# Altium project FPGA_SHIELD_MARK1.PrjPcb (part 2 of 2)

## Sheet LOGIC_MCU.SchDoc: MCU Logic
size B; Engineer: M. Jones; Organization: Michael Jones; DocumentNumber: 5; Revision: RA.1; SheetNumber: 5; SheetTotal: 7
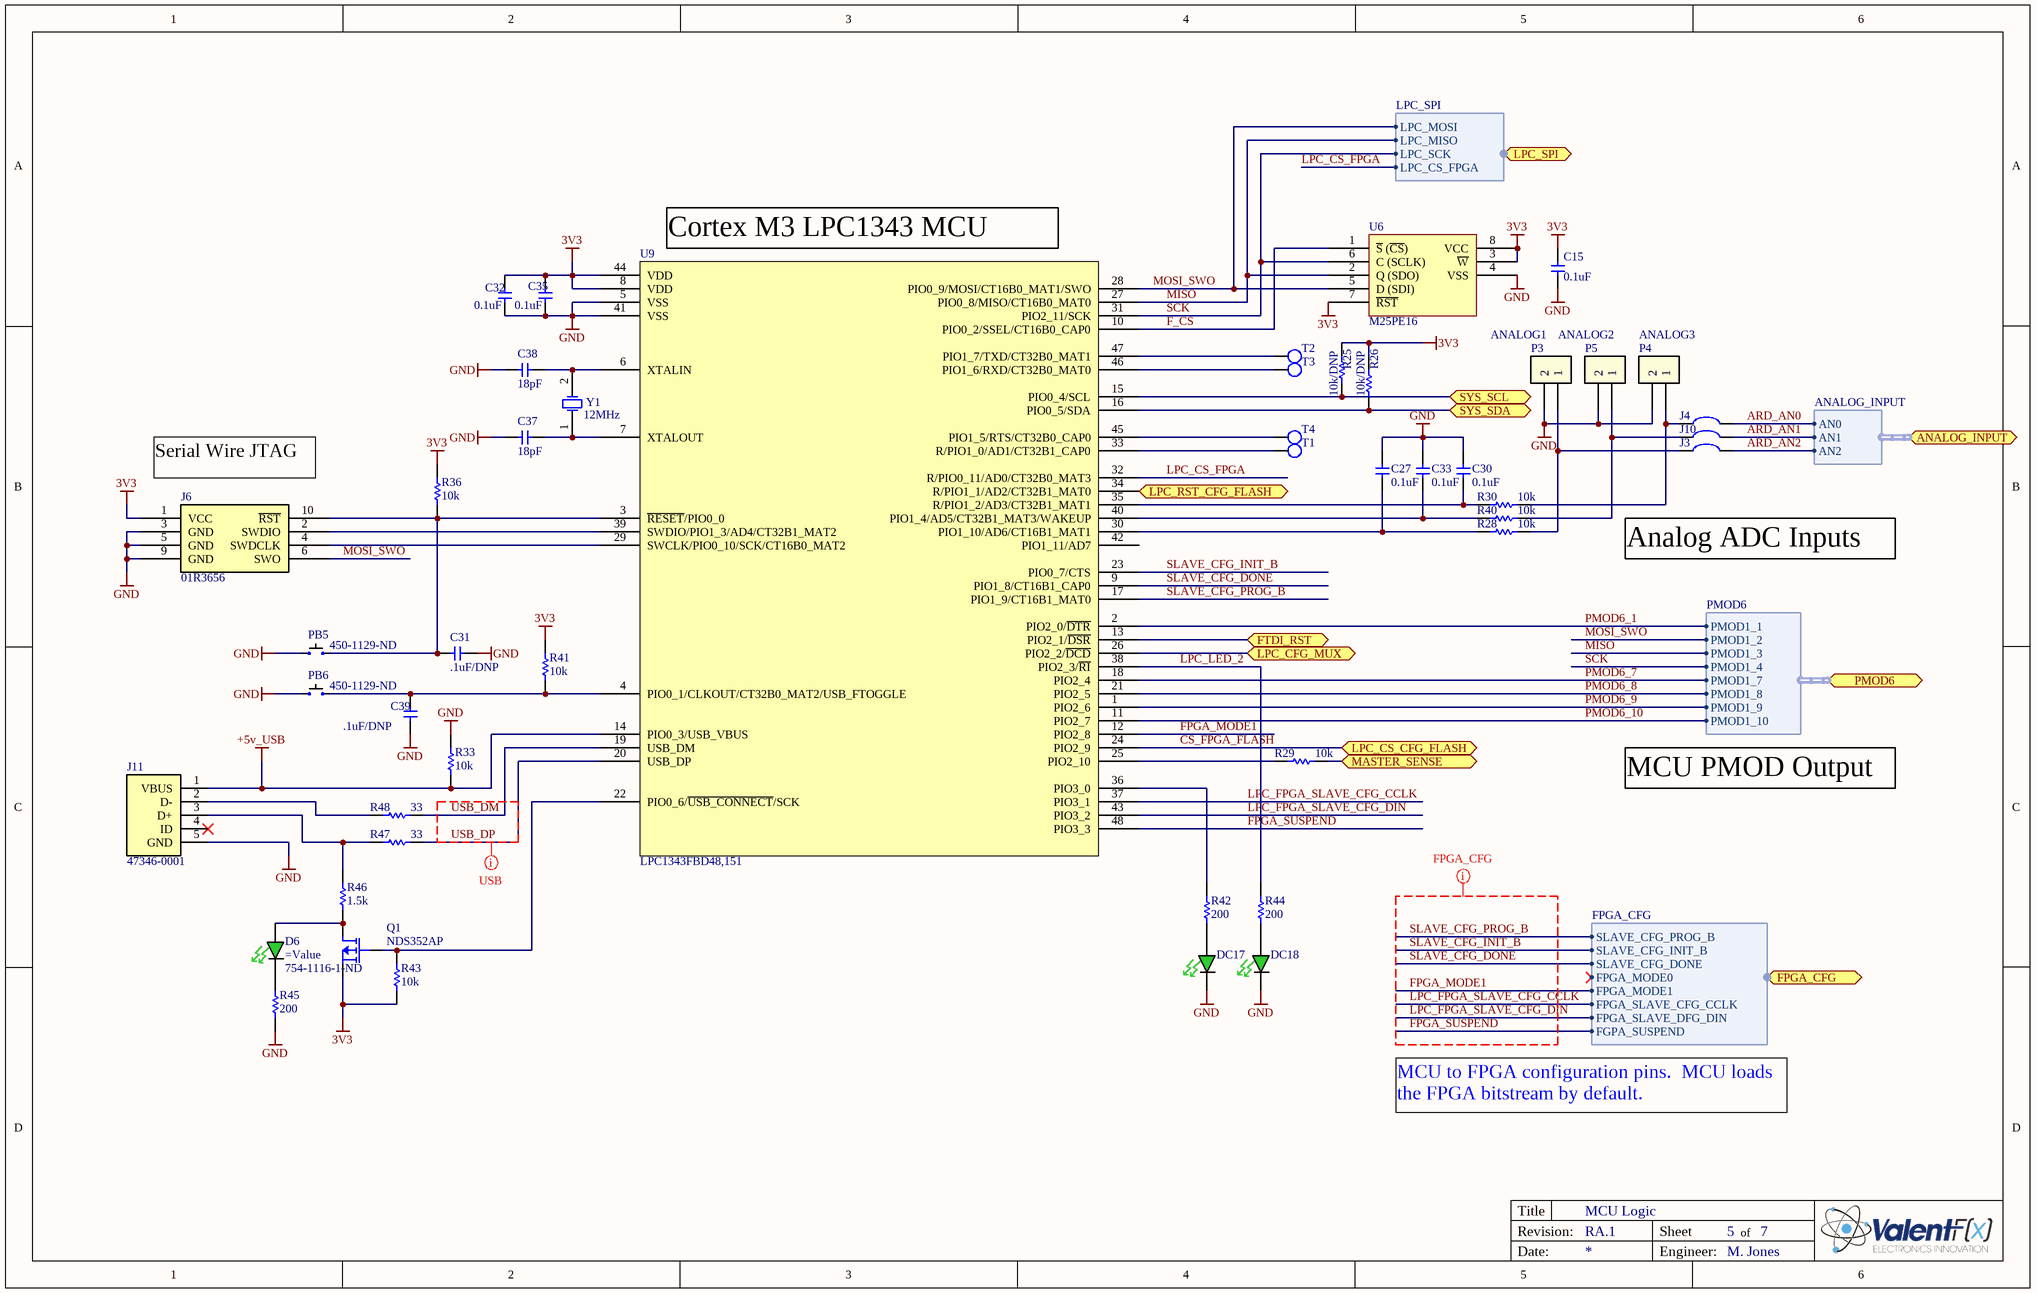
[diagram p4: LOGIC_MCU.SchDoc]

### Parts
C15  0.1uF  [C0603]
C27  0.1uF  [C0603]
C30  0.1uF  [C0603]
C31  .1uF/DNP  [C0603]
C32  0.1uF  [C0603]
C33  0.1uF  [C0603]
C35  0.1uF  [C0603]
C37  18pF  [C0603]
C38  18pF  [C0603]
C39  .1uF/DNP  [C0603]
D6  Supplier Part Number 1: 754-1116-1-ND  [LED_0603 - GREEN]
DC17  (no value)  [LED_0603 - GREEN]
DC18  (no value)  [LED_0603 - GREEN]
J3  Solder Jumper  [SOLDER_JUMPER SMALL 2]  (value not drawn)
J4  Solder Jumper  [SOLDER_JUMPER SMALL 2]  (value not drawn)
J6  01R3656  [FTSH-105-04-F-DV]
J10  Solder Jumper  [SOLDER_JUMPER SMALL 2]  (value not drawn)
J11  47346-0001  [USB - 47346-0001]
P3  ANALOG1  [HEADER_2_30_100 THRU SIP]
P4  ANALOG3  [HEADER_2_30_100 THRU SIP]
P5  ANALOG2  [HEADER_2_30_100 THRU SIP]
PB5  Supplier Part Number 1: 450-1129-ND  [FSM4JSMA]
PB6  Supplier Part Number 1: 450-1129-ND  [FSM4JSMA]
Q1  NDS352AP  [SOT-23]
R25  value 10k/DNP  [R0603]  (hidden comment: 10k)
R26  value 10k/DNP  [R0603]  (hidden comment: 10k)
R28  10k  [R0603]
R29  10k  [R0603]
R30  10k  [R0603]
R33  10k  [R0603]
R36  10k  [R0603]
R40  10k  [R0603]
R41  10k  [R0603]
R42  200  [R0603]
R43  10k  [R0603]
R44  200  [R0603]
R45  200  [R0603]
R46  1.5k  [R0603]
R47  33  [R0603]
R48  33  [R0603]
T1  Test Point  [tp 18-28]  (value not drawn)
T2  Test Point  [tp 18-28]  (value not drawn)
T3  Test Point  [tp 18-28]  (value not drawn)
T4  Test Point  [tp 18-28]  (value not drawn)
U6  M25PE16  [SOIC127P830X200-8L]
U9  LPC1343FBD48,151  [TSQFP50P900X900X145-48L]
Y1  12MHz  [ABM3]

### Ports
ANALOG_INPUT (harness ANALOG_INPUT), FPGA_CFG (harness FPGA_CFG), FTDI_RST, LPC_CFG_MUX, LPC_CS_CFG_FLASH, LPC_RST_CFG_FLASH, LPC_SPI (harness LPC_SPI), MASTER_SENSE, PMOD6 (harness PMOD6), SYS_SCL, SYS_SDA

### Harnesses
FPGA_CFG: SLAVE_CFG_PROG_B, SLAVE_CFG_INIT_B, SLAVE_CFG_DONE, FPGA_MODE0, FPGA_MODE1, FPGA_SLAVE_CFG_CCLK, FPGA_SLAVE_DFG_DIN, FGPA_SUSPEND
PMOD6: PMOD1_1, PMOD1_2, PMOD1_3, PMOD1_4, PMOD1_7, PMOD1_8, PMOD1_9, PMOD1_10
ANALOG_INPUT: AN0, AN1, AN2
LPC_SPI: LPC_MOSI, LPC_MISO, LPC_SCK, LPC_CS_FPGA

### Nets
3V3: C15.2 C32.2 C35.2 J6.1(VCC) Q1.2(S) R25.2 R26.2 R36.1 R41.1 R43.2 U6.3(~{W}) U6.7(~{RST}) U6.8(VCC) U9.8(VDD) U9.44(VDD)
+5v_USB: J11.1(VBUS) R33.2 U9.14(PIO0_3/USB_VBUS)
GND: C15.1 C27.2 C30.2 C31.1 C32.1 C33.2 C35.1 C37.1 C38.1 C39.1 DC17.C DC18.C J6.3(GND) J6.5(GND) J6.9(GND) J11.5(GND) P3.2 P4.2 P5.2 PB5.A PB6.A R33.1 R45.1 U6.4(VSS) U9.5(VSS) U9.41(VSS)
ARD_AN0: J4.2 ; port ANALOG_INPUT.AN0  [project net AN0]
ARD_AN1: J10.2 ; port ANALOG_INPUT.AN1  [project net AN1]
ARD_AN2: J3.2 ; port ANALOG_INPUT.AN2  [project net AN2]
CS_FPGA_FLASH: U9.24(PIO2_9) ; port LPC_CS_CFG_FLASH
F_CS: U6.1(~{S}_(~{CS})) U9.10(PIO0_2/SSEL/CT16B0_CAP0)
FPGA_MODE1: U9.12(PIO2_8) ; port FPGA_CFG.FPGA_MODE1
FPGA_SUSPEND: U9.48(PIO3_3) ; port FPGA_CFG.FGPA_SUSPEND
FTDI_RST: U9.13(PIO2_1/~{DSR}) ; port FTDI_RST
LPC_CS_FPGA: U9.32(R/PIO0_11/AD0/CT32B0_MAT3) ; port LPC_SPI.LPC_CS_FPGA
LPC_FPGA_SLAVE_CFG_CCLK: U9.37(PIO3_1) ; port FPGA_CFG.FPGA_SLAVE_CFG_CCLK
LPC_FPGA_SLAVE_CFG_DIN: U9.43(PIO3_2) ; port FPGA_CFG.FPGA_SLAVE_DFG_DIN
LPC_LED_2: R44.1 U9.38(PIO2_3/~{RI})
MASTER_SENSE: R29.2 ; port MASTER_SENSE
MISO: U6.2(Q_(SDO)) U9.27(PIO0_8/MISO/CT16B0_MAT0) ; port PMOD6.PMOD1_3, port LPC_SPI.LPC_MISO
MOSI_SWO: J6.6(SWO) U6.5(D_(SDI)) U9.28(PIO0_9/MOSI/CT16B0_MAT1/SWO) ; port PMOD6.PMOD1_2, port LPC_SPI.LPC_MOSI
PMOD6_1: U9.2(PIO2_0/~{DTR}) ; port PMOD6.PMOD1_1
PMOD6_7: U9.18(PIO2_4) ; port PMOD6.PMOD1_7
PMOD6_8: U9.21(PIO2_5) ; port PMOD6.PMOD1_8
PMOD6_9: U9.1(PIO2_6) ; port PMOD6.PMOD1_9
PMOD6_10: U9.11(PIO2_7) ; port PMOD6.PMOD1_10
SCK: U6.6(C_(SCLK)) U9.31(PIO2_11/SCK) ; port PMOD6.PMOD1_4, port LPC_SPI.LPC_SCK
SLAVE_CFG_DONE: U9.9(PIO1_8/CT16B1_CAP0) ; port FPGA_CFG.SLAVE_CFG_DONE
SLAVE_CFG_INIT_B: U9.23(PIO0_7/CTS) ; port FPGA_CFG.SLAVE_CFG_INIT_B
SLAVE_CFG_PROG_B: U9.17(PIO1_9/CT16B1_MAT0) ; port FPGA_CFG.SLAVE_CFG_PROG_B
SYS_I2C_SCL: R25.1 U9.15(PIO0_4/SCL) ; port SYS_SCL
SYS_I2C_SDA: R26.1 U9.16(PIO0_5/SDA) ; port SYS_SDA
USB_DM: R48.2 U9.19(USB_DM)
USB_DP: R47.2 U9.20(USB_DP)
NetC27_1: C27.1 R28.1 U9.30(PIO1_10/AD6/CT16B1_MAT1)
NetC30_1: C30.1 R30.1 U9.35(R/PIO1_2/AD3/CT32B1_MAT1)
NetC31_2: C31.2 J6.10(~{RST}) PB5.B R36.2 U9.3(~{RESET}/PIO0_0)
NetC33_1: C33.1 R40.1 U9.40(PIO1_4/AD5/CT32B1_MAT3/WAKEUP)
NetC37_2: C37.2 U9.7(XTALOUT) Y1.1(OSC1)
NetC38_2: C38.2 U9.6(XTALIN) Y1.2(OSC2)
NetC39_2: C39.2 PB6.B R41.2 U9.4(PIO0_1/CLKOUT/CT32B0_MAT2/USB_FTOGGLE)
NetD6_A: D6.A Q1.3(D) R46.1
NetD6_C: D6.C R45.2
NetDC17_A: DC17.A R42.2
NetDC18_A: DC18.A R44.2
NetJ3_1: J3.1 P3.1 R28.2
NetJ4_1: J4.1 P4.1 R30.2
NetJ6_2: J6.2(SWDIO) U9.39(SWDIO/PIO1_3/AD4/CT32B1_MAT2)
NetJ6_4: J6.4(SWDCLK) U9.29(SWCLK/PIO0_10/SCK/CT16B0_MAT2)
NetJ10_1: J10.1 P5.1 R40.2
NetJ11_2: J11.2(D-) R48.1
NetJ11_3: J11.3(D+) R46.2 R47.1
NetQ1_1: Q1.1(G) R43.1 U9.22(PIO0_6/~{USB_CON}~{NECT}/SCK)
NetR29_1: R29.1 U9.25(PIO2_10)
NetR35_1: U9.34(R/PIO1_1/AD2/CT32B1_MAT0) ; port LPC_RST_CFG_FLASH
NetR42_1: R42.1 U9.36(PIO3_0)
NetR49_2: U9.26(PIO2_2/~{DCD}) ; port LPC_CFG_MUX
NetT1_1: T1.1 U9.33(R/PIO1_0/AD1/CT32B1_CAP0)
NetT2_1: T2.1 U9.47(PIO1_7/TXD/CT32B0_MAT1)
NetT3_1: T3.1 U9.46(PIO1_6/RXD/CT32B0_MAT0)
NetT4_1: T4.1 U9.45(PIO1_5/RTS/CT32B0_CAP0)

Not connected (* = marked no-connect by the designer): J11 4(ID)*; U9 42(PIO1_11/AD7)

### Layout directives
net class FPGA_CFG: FPGA_MODE1, FPGA_SUSPEND, LPC_FPGA_SLAVE_CFG_CCLK, LPC_FPGA_SLAVE_CFG_DIN, SLAVE_CFG_DONE, SLAVE_CFG_INIT_B, SLAVE_CFG_PROG_B
net class USB: USB_DP

### Notes on the sheet
- (near U9) Cortex M3 LPC1343 MCU
- (near J6) Serial Wire JTAG
- Analog ADC Inputs
- MCU PMOD Output
- MCU to FPGA configuration pins.  MCU loads the FPGA bitstream by default.
- Title
- Revision:
- Sheet
- of
- Date:
- Engineer:

### Library data of the parts
C15 C27 C30 C32 C33 C35 = GRM188R71H104KA93D: CAP CER .1UF 50V 10% X7R 0603; Manufacturer: Murata Electronics North America; Capacitance: 0.1µF; Value: 0.1uF; Supplier 1: Digi-Key; Supplier Part Number 1: 490-1519-1-ND; Manufacturer Part Number: GRM188R71H104KA93D; RoHS: RoHS Compliant; Category: Capacitors; Stock 1: 6315460; Pricing 1: 10=0.037, 100=0.0221, 500=0.01276, 1000=0.00884 (USD); Voltage - Rated: 50V; Tolerance: ±10%; Temperature Coefficient: X7R; Mounting Type: Surface Mount, MLCC; Operating Temperature: -55°C ~ 125°C; Features: -; Applications: General Purpose; Ratings: -; Package / Case: 0603 (1608 Metric); Size / Dimension: 0.063" L x 0.031" W (1.60mm x 0.80mm); Lead Spacing: -; Thickness: 0.80mm; Packaging: Cut Tape (CT); Lead Style: -; ComponentLink1URL: http://search.murata.co.jp/Ceramy/image/img/PDF/ENG/GRM188R71H104KA93.pdf; ComponentLink1Description: http://search.murata.co.jp/Ceramy/image/img/PDF/ENG/GRM188R71H104KA93.pdf
C31 C39 = GRM188R71H104KA93D: CAP CER .1UF 50V 10% X7R 0603; Manufacturer: Murata Electronics North America; Value: 0.1uF; Capacitance: 0.1µF; Supplier 1: Digi-Key; Supplier Part Number 1: 490-1519-1-ND; Manufacturer Part Number: GRM188R71H104KA93D; RoHS: RoHS Compliant; Category: Capacitors; Stock 1: 6315460; Pricing 1: 10=0.037, 100=0.0221, 500=0.01276, 1000=0.00884 (USD); Voltage - Rated: 50V; Tolerance: ±10%; Temperature Coefficient: X7R; Mounting Type: Surface Mount, MLCC; Operating Temperature: -55°C ~ 125°C; Features: -; Applications: General Purpose; Ratings: -; Package / Case: 0603 (1608 Metric); Size / Dimension: 0.063" L x 0.031" W (1.60mm x 0.80mm); Lead Spacing: -; Thickness: 0.80mm; Packaging: Cut Tape (CT); Lead Style: -; ComponentLink1URL: http://search.murata.co.jp/Ceramy/image/img/PDF/ENG/GRM188R71H104KA93.pdf; ComponentLink1Description: http://search.murata.co.jp/Ceramy/image/img/PDF/ENG/GRM188R71H104KA93.pdf
C37 C38 = GRM1885C1H180JA01D: CAP CER 18PF 50V 5% C0G 0603; Source Part Number: 490-1409-1-ND; Manufacturer: Murata Electronics North America; Temperature Coefficient: C0G, NP0; Source: Digikey; Manufacturer Part Number: GRM1885C1H180JA01D; ROHS Certificate: *; Value: CAP CER 18PF 50V 5% C0G 0603; Supplier 1: Digi-Key; Supplier Part Number 1: 490-1409-1-ND; RoHS: RoHS Compliant; Category: Capacitors; Stock 1: 357140; Pricing 1: 10=0.037, 100=0.0221, 500=0.01276, 1000=0.00884 (USD); Capacitance: 18pF; Voltage - Rated: 50V; Tolerance: ±5%; Mounting Type: Surface Mount, MLCC; Operating Temperature: -55°C ~ 125°C; Features: -; Applications: General Purpose; Ratings: -; Package / Case: 0603 (1608 Metric); Size / Dimension: 0.063" L x 0.031" W (1.60mm x 0.80mm); Lead Spacing: -; Thickness: 0.80mm; Packaging: Cut Tape (CT); Lead Style: -; ComponentLink1URL: http://search.murata.co.jp/Ceramy/image/img/PDF/ENG/GRM1885C1H180JA01.pdf; ComponentLink1Description: http://search.murata.co.jp/Ceramy/image/img/PDF/ENG/GRM1885C1H180JA01.pdf
D6 = APT1608CGCK: LED 1.6X0.8MM 570NM GRN CLR SMD; Manufacturer: Kingbright Corp; Color: Green; Current - Test: 20mA; Wavelength - Peak: 574nm; Millicandela Rating: 50mcd; Voltage - Forward (Vf) Typ: 2.1V; Lens Type: Clear; Lens Style/Size: Rectangle with Flat Top, 1.2mm x 0.8mm; Viewing Angle: 120°; Supplier 1: Digi-Key; Manufacturer Part Number: APT1608CGCK; RoHS: RoHS Compliant; Category: Optoelectronics; Stock 1: 98122; Pricing 1: 1=0.2, 10=0.153, 25=0.1224, 100=0.1105, 250=0.102, 500=0.0918 (USD); Luminous Flux @ Current - Test: -; Wavelength - Dominant: 570nm; Size / Dimension: 1.60mm L x 0.80mm W; Height: 0.75mm; Package / Case: 0603 (1608 Metric); Mounting Type: Surface Mount; Packaging: Cut Tape (CT); ComponentLink1URL: http://www.us.kingbright.com/images/catalog/SPEC/APT1608CGCK.pdf; ComponentLink1Description: http://www.us.kingbright.com/images/catalog/SPEC/APT1608CGCK.pdf
DC17 DC18 = APT1608CGCK: LED 1.6X0.8MM 570NM GRN CLR SMD; Manufacturer: Kingbright Corp; Current - Test: 20mA; Wavelength - Peak: 574nm; Millicandela Rating: 50mcd; Voltage - Forward (Vf) Typ: 2.1V; Lens Type: Clear; Lens Style/Size: Rectangle with Flat Top, 1.2mm x 0.8mm; Viewing Angle: 120°; Supplier 1: Digi-Key; Supplier Part Number 1: 754-1116-1-ND; Manufacturer Part Number: APT1608CGCK; RoHS: RoHS Compliant; Category: Optoelectronics; Stock 1: 98122; Pricing 1: 1=0.2, 10=0.153, 25=0.1224, 100=0.1105, 250=0.102, 500=0.0918 (USD); Color: Green; Luminous Flux @ Current - Test: -; Wavelength - Dominant: 570nm; Size / Dimension: 1.60mm L x 0.80mm W; Height: 0.75mm; Package / Case: 0603 (1608 Metric); Mounting Type: Surface Mount; Packaging: Cut Tape (CT); ComponentLink1URL: http://www.us.kingbright.com/images/catalog/SPEC/APT1608CGCK.pdf; ComponentLink1Description: http://www.us.kingbright.com/images/catalog/SPEC/APT1608CGCK.pdf
J3 J4 J10 = Solder Jumper: Solder/Configuration Jumper; Manufacturer: n/a; Manufacturer Part Number: n/a; Source: n/a; Source Part Number: n/a; ROHS Certificate: n/a
J6 = Cortex SWD  Connector: Cortex SWD Connector; Manufacturer: SAMTEC; Description: SAMTEC - FTSH-105-04-F-DV - .050 X .050; Supplier 1: Newark; Supplier Part Number 1: 01R3656; Manufacturer Part Number: FTSH-105-04-F-DV; Category: Connectors; Stock 1: 0; Pricing 1: 1=0.871, 25000=0.754, 50000=0.705 (USD); Value: 01R3656
J11 = USB - 0473460001: Micro B CONN RCPT 5POS MICRO B USB R/A; Manufacturer: Molex Inc; Description: CONN RCPT 5POS MICRO USB R/A; Connector Type: USB - micro B; Number of Contacts: 5; Gender: Receptacle; Supplier 1: Digi-Key; Manufacturer Part Number: 0473460001; RoHS: RoHS Compliant; Category: Connectors, Interconnects; Stock 1: 2501; Pricing 1: 1=1, 10=0.877, 25=0.8252, 50=0.7906, 100=0.7563, 250=0.68752, 500=0.61876, 1000=0.55 (USD); Specifications: -; Mounting Type: Surface Mount, Right Angle, Horizontal; Features: Shielded; Packaging: Cut Tape (CT); Ingress Protection: -; ComponentLink1URL: http://www.molex.com/pdm_docs/sd/473460001_sd.pdf; ComponentLink1Description: http://www.molex.com/pdm_docs/sd/473460001_sd.pdf; Supplier Part Number 1: WM17141CT-ND; Value: 47346-0001
P3-P5 = Header2: Header 2 pin
PB5 PB6 = FSM4JSMATR: SWITCH TACTILE SPST-NO 0.05A 12V; Manufacturer: TE Connectivity; Switch Function: Off-Mom; Contact Rating @ Voltage: 0.05A @ 12VDC; Actuator Type: Standard; Outline: 6.00mm x 6.00mm; Illumination: Non-Illuminated; Operating Force: 160gf; Actuator Height off PCB, from Pins: 5.00mm; Actuator Orientation: Top Actuated; Actuator Material: Polyphenylene Sulfide (PPS); Switch Travel: 0.25mm; Mechanical Life: 100,000 Cycles; Supplier 1: Digi-Key; Manufacturer Part Number: FSM4JSMA; RoHS: RoHS Compliant; Category: Switches; Stock 1: 13038; Pricing 1: 1=0.26, 10=0.246, 25=0.2096, 50=0.1834, 100=0.1703, 250=0.15064, 500=0.1441, 1000=0.1179, 5000=0.09825 (USD); Circuit: SPST-NO; Mounting Type: Surface Mount; Termination Style: Gull Wing; Packaging: Bulk; ComponentLink1URL: http://www.te.com/commerce/DocumentDelivery/DDEController?Action=srchrtrv&DocNm=2-1437565-7&DocType=Customer+Drawing&DocLang=English; ComponentLink1Description: http://www.te.com/commerce/DocumentDelivery/DDEController?Action=srchrtrv&DocNm=2-1437565-7&DocType=Customer+Drawing&DocLang=English; Illumination Voltage (Nominal): -; Illumination Type, Color: -; Ingress Protection: -; Features: -; Operating Temperature: -35°C ~ 85°C
Q1 = NDS352AP: MOSFET P-CH 30V 900MA SSOT3; Manufacturer: Fairchild Semiconductor; FET Type: MOSFET P-Channel, Metal Oxide; FET Feature: Logic Level Gate; Rds On (Max) @ Id, Vgs: 300 mOhm @ 1A, 10V; Vgs(th) (Max) @ Id: 2.5V @ 250µA; Gate Charge (Qg) @ Vgs: 3nC @ 4.5V; Input Capacitance (Ciss) @ Vds: 135pF @ 15V; Power - Max: 460mW; Value: NDS352AP; Supplier 1: Digi-Key; Supplier Part Number 1: NDS352APCT-ND; Manufacturer Part Number: NDS352AP; RoHS: RoHS Compliant; Category: Discrete Semiconductor Products; Stock 1: 165125; Pricing 1: 1=0.61, 10=0.485, 100=0.364, 250=0.31436, 500=0.27024, 750=0.23163, 1000=0.20957, 2000=0.19303 (USD); Drain to Source Voltage (Vdss): 30V; Current - Continuous Drain (Id) @ 25° C: 900mA; Mounting Type: Surface Mount; Package / Case: TO-236-3, SC-59, SOT-23-3; Packaging: Cut Tape (CT); Supplier Device Package: 3-SSOT; ComponentLink1URL: http://media.digikey.com/pdf/Data%20Sheets/Fairchild%20PDFs/NDS352AP.pdf; ComponentLink1Description: http://media.digikey.com/pdf/Data%20Sheets/Fairchild%20PDFs/NDS352AP.pdf
R25 R26 R28-R30 R33 R36 R40 R41 R43 = ERJ-3EKF1002V: RES 10.0K OHM 1/10W 1% 0603 SMD; Source Part Number: P10.0KHCT-ND; Manufacturer: Panasonic - ECG; Power (Watts): 0.1W, 1/10W; Temperature Coefficient: ±100ppm/°C; Source: Digikey; ROHS Certificate: *; RoHS: RoHS Compliant; Category: Resistors; Resistance In Ohms: 10.0K; Composition: Thick Film; Features: -; Tolerance: ±1%; Case: 0603 (1608 metric); Size / Dimension: 0.063" L x 0.031" W (1.60mm x 0.80mm); Height: 0.018" (0.45mm); Lead Style: Surface Mount (SMD - SMT); Packaging: Cut Tape (CT); ComponentLink1URL: http://industrial.panasonic.com/www-cgi/jvcr13pz.cgi?E+PZ+3+AOA0002+ERJ3EKF1002V+7+WW; ComponentLink1Description: http://industrial.panasonic.com/www-cgi/jvcr13pz.cgi?E+PZ+3+AOA0002+ERJ3EKF1002V+7+WW; Manufacturer Part Number: ERJ-3EKF1002V; Supplier 1: Digi-Key; Stock 1: 10570746; Pricing 1: 1=0.04, 50=0.015, 100=0.0114, 250=0.00844, 500=0.00624, 1000=0.00416 (USD); Supplier Part Number 1: P10.0KHCT-ND
  R28-R30 R33 R36 R40 R41 R43: Value: 10k
R42 R44 R45 = ERJ-3EKF2000V: RES 200 OHM 1/10W 1% 0603 SMD; Manufacturer: Panasonic - ECG; Power (Watts): 0.1W, 1/10W; Temperature Coefficient: ±100ppm/°C; Manufacturer Part Number: ERJ-3EKF2000V; Value: RES 200 OHM 1/10W 1% 0603 SMD; Supplier 1: Digi-Key; Supplier Part Number 1: P200HCT-ND; RoHS: RoHS Compliant; Category: Resistors; Stock 1: 1279595; Pricing 1: 1=0.04, 50=0.015, 100=0.0114, 250=0.00844, 500=0.00624, 1000=0.00416 (USD); Resistance (Ohms): 200; Composition: Thick Film; Features: -; Tolerance: ±1%; Size / Dimension: 0.063" L x 0.031" W (1.60mm x 0.80mm); Height: 0.018" (0.45mm); Lead Style: Surface Mount (SMD - SMT); Packaging: Cut Tape (CT); Package / Case: 0603 (1608 Metric); ComponentLink1URL: http://industrial.panasonic.com/www-cgi/jvcr13pz.cgi?E+PZ+3+AOA0002+ERJ3EKF2000V+7+WW; ComponentLink1Description: http://industrial.panasonic.com/www-cgi/jvcr13pz.cgi?E+PZ+3+AOA0002+ERJ3EKF2000V+7+WW
R46 = ERJ-3EKF1501V: RES 1.50K OHM 1/10W 1% 0603 SMD; Manufacturer: Panasonic - ECG; Power (Watts): 0.1W, 1/10W; Temperature Coefficient: ±100ppm/°C; Value: 1.5k; Supplier 1: Digi-Key; Supplier Part Number 1: P1.50KHCT-ND; Manufacturer Part Number: ERJ-3EKF1501V; RoHS: RoHS Compliant; Category: Resistors; Stock 1: 1714688; Pricing 1: 1=0.04, 50=0.015, 100=0.0114, 250=0.00844, 500=0.00624, 1000=0.00416 (USD); Resistance (Ohms): 1.50K; Composition: Thick Film; Features: -; Tolerance: ±1%; Size / Dimension: 0.063" L x 0.031" W (1.60mm x 0.80mm); Height: 0.018" (0.45mm); Lead Style: Surface Mount (SMD - SMT); Packaging: Cut Tape (CT); Package / Case: 0603 (1608 Metric); ComponentLink1URL: http://industrial.panasonic.com/www-cgi/jvcr13pz.cgi?E+PZ+3+AOA0002+ERJ3EKF1501V+7+WW; ComponentLink1Description: http://industrial.panasonic.com/www-cgi/jvcr13pz.cgi?E+PZ+3+AOA0002+ERJ3EKF1501V+7+WW
R47 R48 = ERJ-3EKF33R0V: RES 33.0 OHM 1/10W 1% 0603 SMD; Manufacturer: Panasonic - ECG; Resistance (Ohms): 33.0; Power (Watts): 0.1W, 1/10W; Temperature Coefficient: ±100ppm/°C; Value: 33; Supplier 1: Digi-Key; Supplier Part Number 1: P33.0HCT-ND; Manufacturer Part Number: ERJ-3EKF33R0V; RoHS: RoHS Compliant; Category: Resistors; Stock 1: 247775; Pricing 1: 1=0.04, 50=0.015, 100=0.0114, 250=0.00844, 500=0.00624, 1000=0.00416 (USD); Composition: Thick Film; Features: -; Tolerance: ±1%; Size / Dimension: 0.063" L x 0.031" W (1.60mm x 0.80mm); Height: 0.018" (0.45mm); Lead Style: Surface Mount (SMD - SMT); Packaging: Cut Tape (CT); Package / Case: 0603 (1608 Metric); ComponentLink1URL: http://industrial.panasonic.com/www-cgi/jvcr13pz.cgi?E+PZ+3+AOA0002+ERJ3EKF33R0V+7+WW; ComponentLink1Description: http://industrial.panasonic.com/www-cgi/jvcr13pz.cgi?E+PZ+3+AOA0002+ERJ3EKF33R0V+7+WW
T1-T4 = Test Point 2: Test Point Smaller Symbol
U6 = M25PE16-VMW6TG: IC FLASH 16MBIT 75MHZ 8SOIC; Manufacturer: Numonyx/ST Micro; Memory Size: 16M (2M x 8); Interface: SPI, 3-Wire Serial; Voltage - Supply: 2.7 V ~ 3.6 V; Supplier 1: Digi-Key; Manufacturer Part Number: M25PE16-VMW6TG; RoHS: RoHS Compliant; Category: Integrated Circuits (ICs); Stock 1: 866; Pricing 1: 1=2.31, 10=1.98, 25=1.782, 100=1.617, 250=1.452, 500=1.254 (USD); Format - Memory: FLASH; Memory Type: FLASH; Speed: 75MHz; Operating Temperature: -40°C ~ 85°C; Package / Case: 8-SOIC (0.200", 5.30mm Width); Packaging: Cut Tape (CT); Supplier Device Package: *; ComponentLink1URL: http://www.numonyx.com/Documents/Datasheets/M25PE16.pdf; ComponentLink1Description: http://www.numonyx.com/Documents/Datasheets/M25PE16.pdf; Supplier Part Number 1: M25PE16-VMW6TGCT-ND; Value: M25PE16
U9 = LPC1343FBD48,151: IC MCU 32BIT 32KB FLASH 48LQFP; Manufacturer: NXP Semiconductors; Core Processor: ARM® Cortex-M3™; Core Size: 32-Bit; Speed: 72MHz; Connectivity: I²C, Microwire, SPI, SSI, SSP, UART/USART, USB; Peripherals: Brown-out Detect/Reset, POR, WDT; Number of I /O: 40; Program Memory Size: 32KB (32K x 8); RAM Size: 8K x 8; Voltage - Supply (Vcc/Vdd): 2 V ~ 3.6 V; Data Converters: A/D 8x10b; Oscillator Type: Internal; Value: LPC1343FBD48,151; Supplier 1: Digi-Key; Supplier Part Number 1: 568-4945-ND; Manufacturer Part Number: LPC1343FBD48,151; RoHS: RoHS Compliant; Category: Integrated Circuits (ICs); Stock 1: 734; Pricing 1: 1=6.3, 25=5.0624, 100=4.6125, 250=4.16252, 500=3.735, 1000=3.15, 2500=2.9925, 5000=2.86875 (USD); Program Memory Type: FLASH; EEPROM Size: -; Operating Temperature: -40°C ~ 85°C; Package / Case: 48-LQFP; Packaging: Tray; ComponentLink1URL: http://ics.nxp.com/products/lpc1000/datasheet/lpc1311.lpc1313.lpc1342.lpc1343.pdf; ComponentLink1Description: http://ics.nxp.com/products/lpc1000/datasheet/lpc1311.lpc1313.lpc1342.lpc1343.pdf
Y1 = ABM3-12.000MHZ-B2-T: CRYSTAL 12.000MHZ 18PF SMD; Manufacturer: Abracon Corporation; Frequency Stability: ±50ppm; Frequency Tolerance: ±20ppm; Operating Mode: Fundamental; Supplier 1: Digi-Key; Manufacturer Part Number: ABM3-12.000MHZ-B2-T; RoHS: RoHS Compliant; Category: Crystals and Oscillators; Stock 1: 22557; Pricing 1: 1=1.88, 10=1.625, 50=1.425, 100=1.125, 500=0.95 (USD); Type: MHz Crystal; Frequency: 12MHz; Load Capacitance: 18pF; Operating Temperature: -20°C ~ 70°C; Mounting Type: Surface Mount; Package / Case: 2-SMD, No Lead (DFN, LCC); Size / Dimension: 0.197" L x 0.126" W (5.00mm x 3.20mm); Height: 0.051" (1.30mm); Packaging: Cut Tape (CT); ComponentLink1URL: http://www.abracon.com/Resonators/abm3.pdf; ComponentLink1Description: http://www.abracon.com/Resonators/abm3.pdf; Supplier Part Number 1: 535-9100-1-ND; Value: 12MHz

## Sheet PMOD_IO.SchDoc: PMOD Expansion IO
size B; Engineer: M. Jones; Organization: Michael Jones; DocumentNumber: 6; Revision: RA.1; SheetNumber: 6; SheetTotal: 7
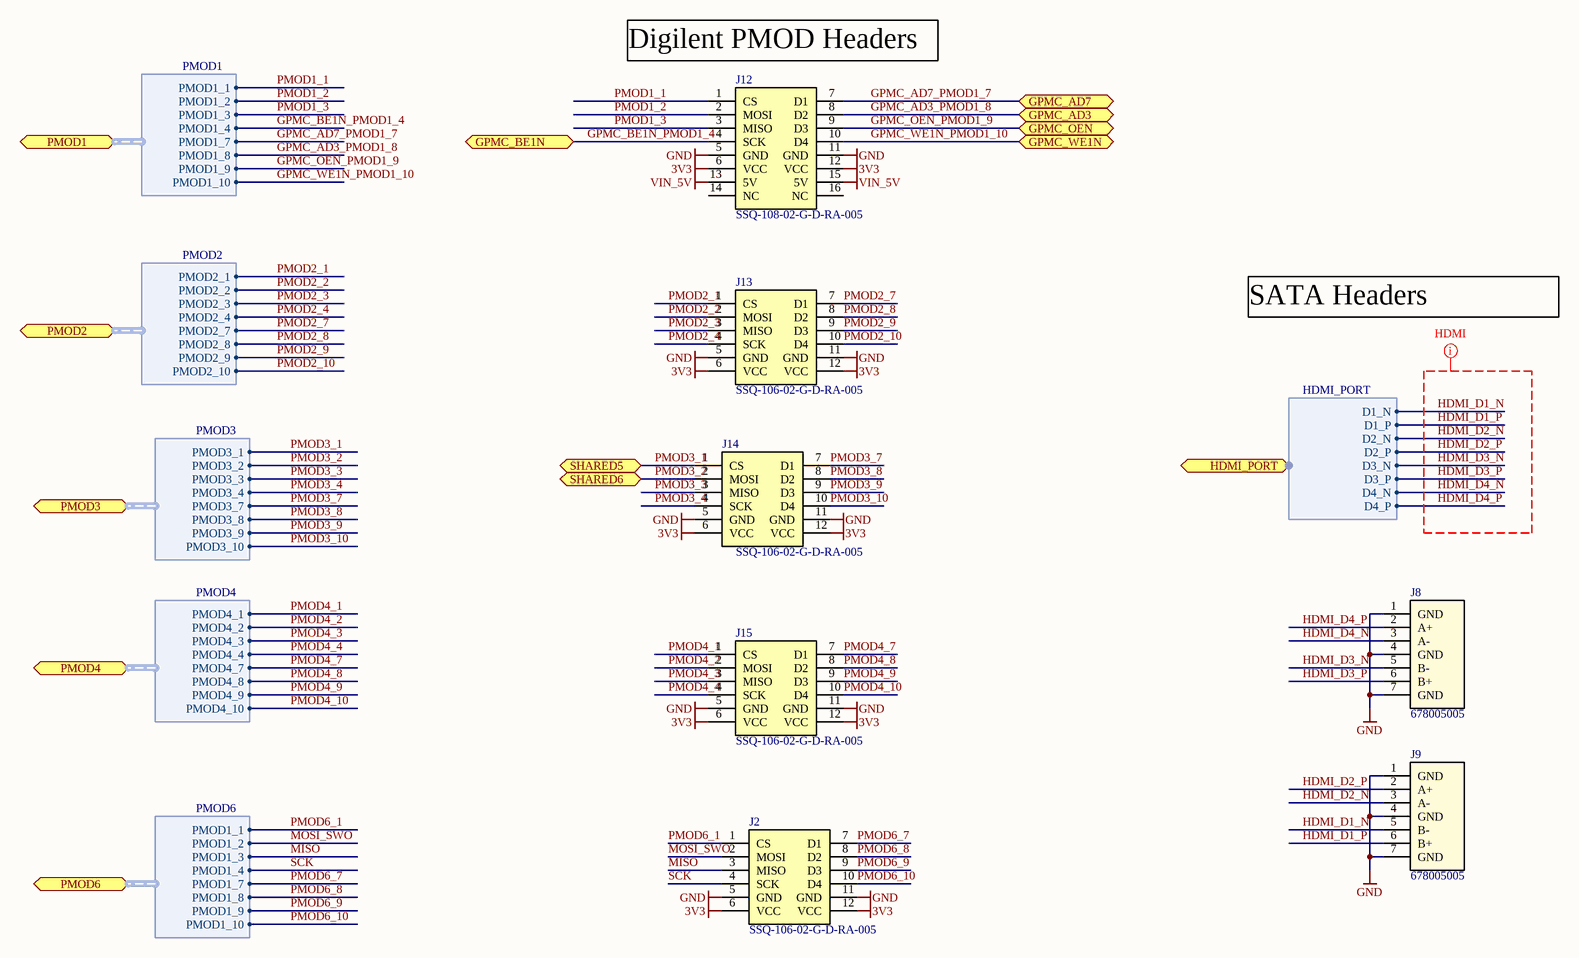
[diagram p5: PMOD_IO.SchDoc]

### Parts
J2  SSQ-106-02-G-D-RA-005  [PMOD HEADER - SSQ-106-02-G-D-RA]
J8  678005005  [SATA - 67800-5005]
J9  678005005  [SATA - 67800-5005]
J12  SSQ-108-02-G-D-RA-005  [PMOD HEADER8 - SSQ-108-02-G-D-RA]
J13  SSQ-106-02-G-D-RA-005  [PMOD HEADER - SSQ-106-02-G-D-RA]
J14  SSQ-106-02-G-D-RA-005  [PMOD HEADER - SSQ-106-02-G-D-RA]
J15  SSQ-106-02-G-D-RA-005  [PMOD HEADER - SSQ-106-02-G-D-RA]

### Ports
GPMC_AD3, GPMC_AD7, GPMC_BE1N, GPMC_OEN, GPMC_WE1N, HDMI_PORT (harness HDMI_PORT), PMOD1 (harness PMOD1), PMOD2 (harness PMOD2), PMOD3 (harness PMOD3), PMOD4 (harness PMOD4), PMOD6 (harness PMOD6), SHARED5, SHARED6

### Harnesses
PMOD1: PMOD1_1, PMOD1_2, PMOD1_3, PMOD1_4, PMOD1_7, PMOD1_8, PMOD1_9, PMOD1_10
PMOD2: PMOD2_1, PMOD2_2, PMOD2_3, PMOD2_4, PMOD2_7, PMOD2_8, PMOD2_9, PMOD2_10
PMOD3: PMOD3_1, PMOD3_2, PMOD3_3, PMOD3_4, PMOD3_7, PMOD3_8, PMOD3_9, PMOD3_10
PMOD4: PMOD4_1, PMOD4_2, PMOD4_3, PMOD4_4, PMOD4_7, PMOD4_8, PMOD4_9, PMOD4_10
PMOD6: PMOD1_1, PMOD1_2, PMOD1_3, PMOD1_4, PMOD1_7, PMOD1_8, PMOD1_9, PMOD1_10
HDMI_PORT: D1_P, D1_N, D2_N, D3_N, D4_N, D2_P, D3_P, D4_P

### Nets
3V3: J2.6(VCC) J2.12(VCC) J12.6(VCC) J12.12(VCC) J13.6(VCC) J13.12(VCC) J14.6(VCC) J14.12(VCC) J15.6(VCC) J15.12(VCC)
GND: J2.5(GND) J2.11(GND) J8.1(GND) J8.4(GND) J8.7(GND) J9.1(GND) J9.4(GND) J9.7(GND) J12.5(GND) J12.11(GND) J13.5(GND) J13.11(GND) J14.5(GND) J14.11(GND) J15.5(GND) J15.11(GND)
VIN_5V: J12.13(5V) J12.15(5V)
GPMC_AD3_PMOD1_8: J12.8(D2) ; port GPMC_AD3, port PMOD1.PMOD1_8
GPMC_AD7_PMOD1_7: J12.7(D1) ; port GPMC_AD7, port PMOD1.PMOD1_7
GPMC_BE1N_PMOD1_4: J12.4(SCK) ; port GPMC_BE1N, port PMOD1.PMOD1_4
GPMC_OEN_PMOD1_9: J12.9(D3) ; port GPMC_OEN, port PMOD1.PMOD1_9
GPMC_WE1N_PMOD1_10: J12.10(D4) ; port GPMC_WE1N, port PMOD1.PMOD1_10
HDMI_D1_N: J9.5(B-) ; port HDMI_PORT.D1_N
HDMI_D1_P: J9.6(B+) ; port HDMI_PORT.D1_P
HDMI_D2_N: J9.3(A-) ; port HDMI_PORT.D2_N
HDMI_D2_P: J9.2(A+) ; port HDMI_PORT.D2_P
HDMI_D3_N: J8.5(B-) ; port HDMI_PORT.D3_N
HDMI_D3_P: J8.6(B+) ; port HDMI_PORT.D3_P
HDMI_D4_N: J8.3(A-) ; port HDMI_PORT.D4_N
HDMI_D4_P: J8.2(A+) ; port HDMI_PORT.D4_P
MISO: J2.3(MISO) ; port PMOD6.PMOD1_3
MOSI_SWO: J2.2(MOSI) ; port PMOD6.PMOD1_2
PMOD1_1: J12.1(CS) ; port PMOD1.PMOD1_1
PMOD1_2: J12.2(MOSI) ; port PMOD1.PMOD1_2
PMOD1_3: J12.3(MISO) ; port PMOD1.PMOD1_3
PMOD2_1: J13.1(CS) ; port PMOD2.PMOD2_1
PMOD2_2: J13.2(MOSI) ; port PMOD2.PMOD2_2
PMOD2_3: J13.3(MISO) ; port PMOD2.PMOD2_3
PMOD2_4: J13.4(SCK) ; port PMOD2.PMOD2_4
PMOD2_7: J13.7(D1) ; port PMOD2.PMOD2_7
PMOD2_8: J13.8(D2) ; port PMOD2.PMOD2_8
PMOD2_9: J13.9(D3) ; port PMOD2.PMOD2_9
PMOD2_10: J13.10(D4) ; port PMOD2.PMOD2_10
PMOD3_1: J14.1(CS) ; port SHARED5, port PMOD3.PMOD3_1
PMOD3_2: J14.2(MOSI) ; port SHARED6, port PMOD3.PMOD3_2
PMOD3_3: J14.3(MISO) ; port PMOD3.PMOD3_3
PMOD3_4: J14.4(SCK) ; port PMOD3.PMOD3_4
PMOD3_7: J14.7(D1) ; port PMOD3.PMOD3_7
PMOD3_8: J14.8(D2) ; port PMOD3.PMOD3_8
PMOD3_9: J14.9(D3) ; port PMOD3.PMOD3_9
PMOD3_10: J14.10(D4) ; port PMOD3.PMOD3_10
PMOD4_1: J15.1(CS) ; port PMOD4.PMOD4_1
PMOD4_2: J15.2(MOSI) ; port PMOD4.PMOD4_2
PMOD4_3: J15.3(MISO) ; port PMOD4.PMOD4_3
PMOD4_4: J15.4(SCK) ; port PMOD4.PMOD4_4
PMOD4_7: J15.7(D1) ; port PMOD4.PMOD4_7
PMOD4_8: J15.8(D2) ; port PMOD4.PMOD4_8
PMOD4_9: J15.9(D3) ; port PMOD4.PMOD4_9
PMOD4_10: J15.10(D4) ; port PMOD4.PMOD4_10
PMOD6_1: J2.1(CS) ; port PMOD6.PMOD1_1
PMOD6_7: J2.7(D1) ; port PMOD6.PMOD1_7
PMOD6_8: J2.8(D2) ; port PMOD6.PMOD1_8
PMOD6_9: J2.9(D3) ; port PMOD6.PMOD1_9
PMOD6_10: J2.10(D4) ; port PMOD6.PMOD1_10
SCK: J2.4(SCK) ; port PMOD6.PMOD1_4

Not connected (* = marked no-connect by the designer): J12 14(NC) 16(NC)

### Layout directives
net class HDMI: HDMI_D1_N, HDMI_D1_P, HDMI_D2_N, HDMI_D2_P, HDMI_D3_N, HDMI_D3_P, HDMI_D4_N, HDMI_D4_P

### Notes on the sheet
- (near J12) Digilent PMOD Headers
- SATA Headers
- Title
- Revision:
- Sheet
- of
- Date:
- Engineer:

### Library data of the parts
J2 J13-J15 = P-MOD - SSQ-106-02-G-D-RA-005: SAMTEC - SSQ-106-02-G-D-RA-005 - 2MM SOCKET STRIPS; Supplier 1: Newark; Supplier Part Number 1: 81P8253; Manufacturer: SAMTEC; Manufacturer Part Number: SSQ-106-02-G-D-RA-005; Stock 1: 0; Pricing 1: 1=1.58, 20834=1.4, 41667=1.32 (USD); Value: SSQ-106-02-G-D-RA-005
J8 J9 = SATA - 67800-5005: I/O Connectors 7Ckt Vert Signal Hdr SMT w/ locking latch; Manufacturer: Molex; Current Rating: 1.5 A; Gender: Male; Mounting Angle: Vertical; Voltage Rating: 15 VDC; Pitch: 1.27 mm; Number of Positions / Contacts: 7; Supplier 1: Mouser; Manufacturer Part Number: 67800-5005; RoHS: RoHS Compliant; Category: I/O Connectors; Stock 1: 2502; Pricing 1: 1=1.05, 10=0.929, 25=0.837, 50=0.801, 100=0.728, 250=0.655, 500=0.582, 1000=0.528, 1500=0.524 (AUD); Color: Black; Contact Plating: Gold; Housing Material: Thermoplastic; Operating Temperature Range: - 35 C to + 85 C; Packaging: Tray; Product: SATA Connectors; Series: 67800; Termination Style: Solder Tail; Contact Material: Brass; Flammability Rating: UL 94 V-0; Mounting Style: Through Hole; Product Category: SAS / SATA Connectors; Standard Pack Qty: 4800; RoHS - Mouser: Y; Minimum Order Quantity: 1; Reeling: False; ComponentLink1URL: http://www.mouser.com/ds/1/276/0678005005_PCB_HEADERS-119857.pdf; ComponentLink1Description: http://www.mouser.com/ds/1/276/0678005005_PCB_HEADERS-119857.pdf; Supplier Part Number 1: 538-67800-5005; Value: 678005005
J12 = P-MOD - SSQ-108-02-G-D-RA-005: SAMTEC - SSQ-108-02-G-D-RA-005 - 2MM SOCKET STRIPS; Supplier 1: Newark; Supplier Part Number 1: 81P8253; Manufacturer: SAMTEC; Manufacturer Part Number: SSQ-108-02-G-D-RA-005; Stock 1: 0; Pricing 1: 1=1.58, 20834=1.4, 41667=1.32 (USD); Value: SSQ-108-02-G-D-RA-005

## Sheet PERIPHERAL_PORT_IO.SchDoc: Peripheral Port IO
size B; Engineer: M. Jones; Organization: Michael Jones; DocumentNumber: 7; Revision: RA.1; SheetNumber: 7; SheetTotal: 7
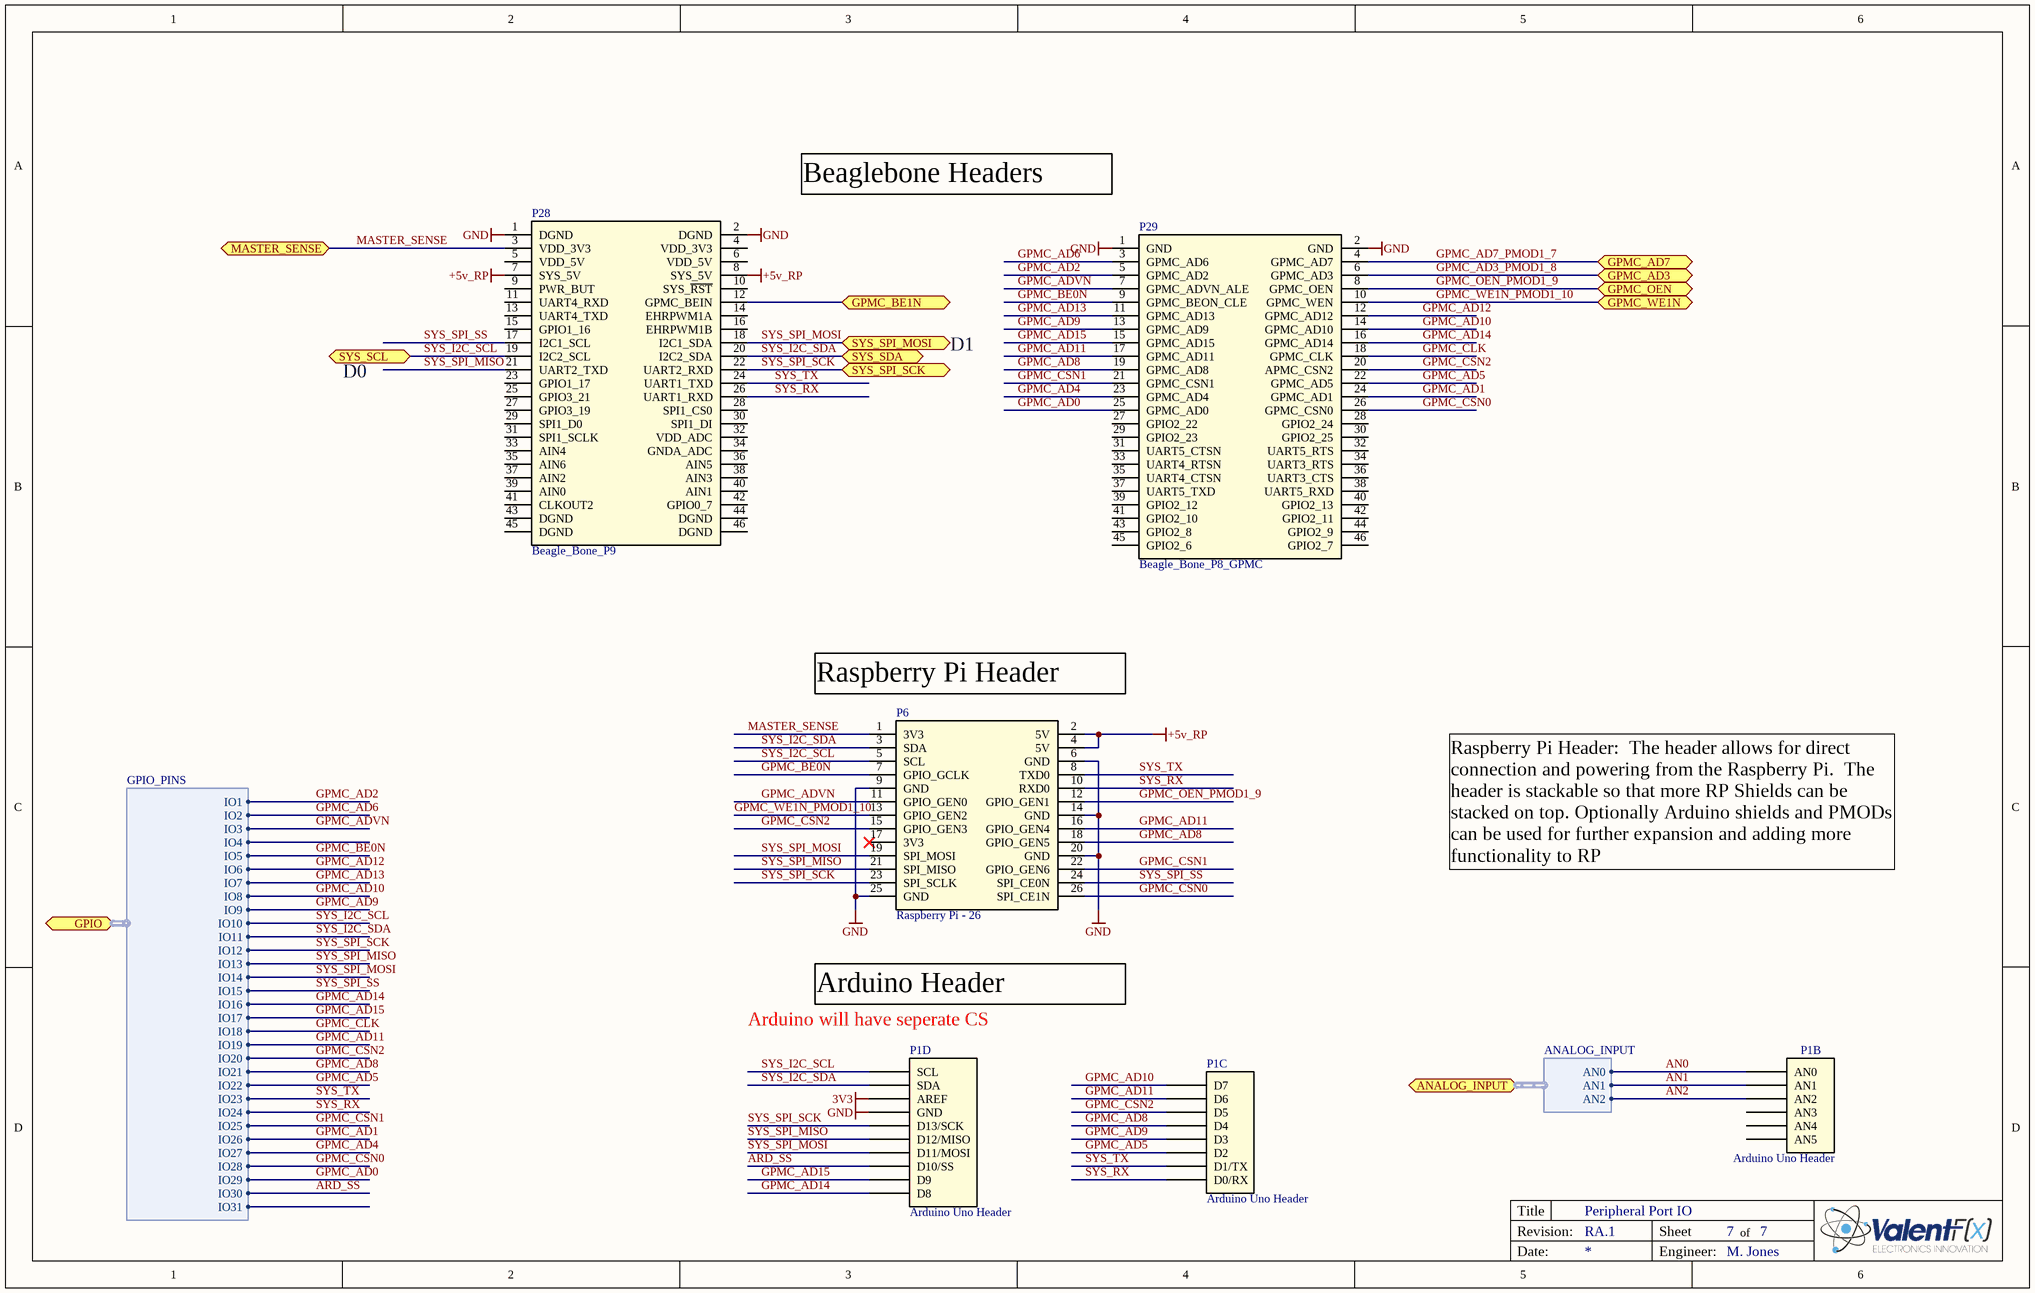
[diagram p6: PERIPHERAL_PORT_IO.SchDoc]

### Parts
P1  Arduino Uno Header  [Arduino Shield - smaller Thru]  (parts B,C,D of 4)
P6  Raspberry Pi - 26  [Raspberr Pi - 26]
P28  Beagle_Bone_P9  [TSM-116-01-F-DV_TH - SHRUNK]
P29  Beagle_Bone_P8_GPMC  [TSM-113-01-F-DV_TH - SHRUNK]

### Ports
ANALOG_INPUT (harness ANALOG_INPUT), GPIO (harness GPIO_PINS), GPMC_AD3, GPMC_AD7, GPMC_BE1N, GPMC_OEN, GPMC_WE1N, MASTER_SENSE, SYS_SCL, SYS_SDA, SYS_SPI_MOSI, SYS_SPI_SCK

### Harnesses
ANALOG_INPUT: AN0, AN1, AN2
GPIO_PINS: IO1, IO2, IO3, IO4, IO5, IO6, IO7, IO8, IO9, IO10, IO11, IO12, IO13, IO14, IO15, IO16, IO17, IO18, IO19, IO20, IO21, IO22, IO23, IO24, IO25, IO26, IO27, IO28, IO29, IO30, IO31

### Nets
3V3: P1.D8(AREF)
+5v_RP: P6.2(5V) P6.4(5V) P28.7(SYS_5V) P28.8(SYS_5V)
GND: P1.D7(GND) P6.6(GND) P6.9(GND) P6.14(GND) P6.20(GND) P6.25(GND) P28.1(DGND) P28.2(DGND) P29.1(GND) P29.2(GND)
AN0: P1.B1(AN0) ; port ANALOG_INPUT.AN0
AN1: P1.B2(AN1) ; port ANALOG_INPUT.AN1
AN2: P1.B3(AN2) ; port ANALOG_INPUT.AN2
ARD_SS: P1.D3(D10/SS) ; port GPIO.IO30
GPMC_AD0: P29.25(GPMC_AD0) ; port GPIO.IO29
GPMC_AD1: P29.24(GPMC_AD1) ; port GPIO.IO26
GPMC_AD2: P29.5(GPMC_AD2) ; port GPIO.IO1
GPMC_AD3_PMOD1_8: P29.6(GPMC_AD3) ; port GPMC_AD3
GPMC_AD4: P29.23(GPMC_AD4) ; port GPIO.IO27
GPMC_AD5: P1.C3(D2) P29.22(GPMC_AD5) ; port GPIO.IO22
GPMC_AD6: P29.3(GPMC_AD6) ; port GPIO.IO2
GPMC_AD7_PMOD1_7: P29.4(GPMC_AD7) ; port GPMC_AD7
GPMC_AD8: P1.C5(D4) P6.18(GPIO_GEN5) P29.19(GPMC_AD8) ; port GPIO.IO21
GPMC_AD9: P1.C4(D3) P29.13(GPMC_AD9) ; port GPIO.IO9
GPMC_AD10: P1.C8(D7) P29.14(GPMC_AD10) ; port GPIO.IO8
GPMC_AD11: P1.C7(D6) P6.16(GPIO_GEN4) P29.17(GPMC_AD11) ; port GPIO.IO19
GPMC_AD12: P29.12(GPMC_AD12) ; port GPIO.IO6
GPMC_AD13: P29.11(GPMC_AD13) ; port GPIO.IO7
GPMC_AD14: P1.D1(D8) P29.16(GPMC_AD14) ; port GPIO.IO16
GPMC_AD15: P1.D2(D9) P29.15(GPMC_AD15) ; port GPIO.IO17
GPMC_ADVN: P6.11(GPIO_GEN0) P29.7(GPMC_ADVN_ALE) ; port GPIO.IO3
GPMC_BE0N: P6.7(GPIO_GCLK) P29.9(GPMC_BEON_CLE) ; port GPIO.IO5
GPMC_BE1N_PMOD1_4: P28.12(GPMC_BEIN) ; port GPMC_BE1N
GPMC_CLK: P29.18(GPMC_CLK) ; port GPIO.IO18
GPMC_CSN0: P6.26(SPI_CE1N) P29.26(GPMC_CSN0) ; port GPIO.IO28
GPMC_CSN1: P6.22(GPIO_GEN6) P29.21(GPMC_CSN1) ; port GPIO.IO25
GPMC_CSN2: P1.C6(D5) P6.15(GPIO_GEN3) P29.20(APMC_CSN2) ; port GPIO.IO20
GPMC_OEN_PMOD1_9: P6.12(GPIO_GEN1) P29.8(GPMC_OEN) ; port GPMC_OEN
GPMC_WE1N_PMOD1_10: P6.13(GPIO_GEN2) P29.10(GPMC_WEN) ; port GPMC_WE1N
MASTER_SENSE: P6.1(3V3) P28.3(VDD_3V3) ; port MASTER_SENSE
SYS_I2C_SCL: P1.D10(SCL) P6.5(SCL) P28.19(I2C2_SCL) ; port SYS_SCL, port GPIO.IO10
SYS_I2C_SDA: P1.D9(SDA) P6.3(SDA) P28.20(I2C2_SDA) ; port SYS_SDA, port GPIO.IO11
SYS_RX: P1.C1(D0/RX) P6.10(RXD0) P28.26(UART1_RXD) ; port GPIO.IO24
SYS_SPI_MISO: P1.D5(D12/MISO) P6.21(SPI_MISO) P28.21(UART2_TXD) ; port GPIO.IO13
SYS_SPI_MOSI: P1.D4(D11/MOSI) P6.19(SPI_MOSI) P28.18(I2C1_SDA) ; port SYS_SPI_MOSI, port GPIO.IO14
SYS_SPI_SCK: P1.D6(D13/SCK) P6.23(SPI_SCLK) P28.22(UART2_RXD) ; port SYS_SPI_SCK, port GPIO.IO12
SYS_SPI_SS: P6.24(SPI_CE0N) P28.17(I2C1_SCL) ; port GPIO.IO15
SYS_TX: P1.C2(D1/TX) P6.8(TXD0) P28.24(UART1_TXD) ; port GPIO.IO23

Not connected (* = marked no-connect by the designer): P1 B4(AN3) B5(AN4) B6(AN5); P6 17(3V3)*; P28 4(VDD_3V3) 5(VDD_5V) 6(VDD_5V) 9(PWR_BUT) 10(SYS_~{RST}) 11(UART4_RXD) 13(UART4_TXD) 14(EHRPWM1A) 15(GPIO1_16) 16(EHRPWM1B) 23(GPIO1_17) 25(GPIO3_21) 27(GPIO3_19) 28(SPI1_CS0) 29(SPI1_D0) 30(SPI1_DI) 31(SPI1_SCLK) 32(VDD_ADC) 33(AIN4) 34(GNDA_ADC) 35(AIN6) 36(AIN5) 37(AIN2) 38(AIN3) 39(AIN0) 40(AIN1) 41(CLKOUT2) 42(GPIO0_7) 43(DGND) 44(DGND) 45(DGND) 46(DGND); P29 27(GPIO2_22) 28(GPIO2_24) 29(GPIO2_23) 30(GPIO2_25) 31(UART5_CTSN) 32(UART5_RTS) 33(UART4_RTSN) 34(UART3_RTS) 35(UART4_CTSN) 36(UART3_CTS) 37(UART5_TXD) 38(UART5_RXD) 39(GPIO2_12) 40(GPIO2_13) 41(GPIO2_10) 42(GPIO2_11) 43(GPIO2_8) 44(GPIO2_9) 45(GPIO2_6) 46(GPIO2_7)

### Notes on the sheet
- Beaglebone Headers
- D1
- D0
- (near P6) Raspberry Pi Header
- Raspberry Pi Header:  The header allows for direct connection and powering from the Raspberry Pi.  The header is stackable so that more RP Shields can be stacked on top. Optionally Arduino shields and PMODs can be used for further expansion and adding more functionality to RP
- (near P1) Arduino will have seperate CS
- Arduino Header
- Title
- Revision:
- Sheet
- of
- Date:
- Engineer:

### Library data of the parts
P1 = Arduino Shield: Arduino Duem Header

## Nets that join several sheets
1V2: POWER_SUPPLY (C16.2 U3.3), FPGA_POWER_AND_CONFIGURATION (10 pins)
3V3: POWER_SUPPLY (5 pins), LOGIC_FPGA (C12.2 U4.1 U4.4), FPGA_POWER_AND_CONFIGURATION (51 pins), DIGITAL_IO (9 pins), LOGIC_MCU (15 pins), PMOD_IO (10 pins), PERIPHERAL_PORT_IO (P1.D8)
+5v_RP: POWER_SUPPLY (D4.2), PERIPHERAL_PORT_IO (P6.2 P6.4 P28.7 P28.8)
+5v_USB: POWER_SUPPLY (D7.2), LOGIC_MCU (J11.1 R33.2 U9.14)
+5v_USB_FTDI: POWER_SUPPLY (D3.2), DIGITAL_IO (C1.2 J1.1 U1.12)
GND: POWER_SUPPLY (11 pins), LOGIC_FPGA (C12.1 U4.2), FPGA_POWER_AND_CONFIGURATION (50 pins), DIGITAL_IO (34 pins), LOGIC_MCU (26 pins), PMOD_IO (16 pins), PERIPHERAL_PORT_IO (10 pins)
VIN_5V: POWER_SUPPLY (10 pins), PMOD_IO (J12.13 J12.15)
AN0: LOGIC_MCU (J4.2), PERIPHERAL_PORT_IO (P1.B1)
AN1: LOGIC_MCU (J10.2), PERIPHERAL_PORT_IO (P1.B2)
AN2: LOGIC_MCU (J3.2), PERIPHERAL_PORT_IO (P1.B3)
ARD_SS: LOGIC_FPGA (U5.67), PERIPHERAL_PORT_IO (P1.D3)
CS_FPGA_FLASH: FPGA_POWER_AND_CONFIGURATION (R39.1 U5.38 U10.1), LOGIC_MCU (U9.24)
DIP_SW0: LOGIC_FPGA (U5.59), DIGITAL_IO (R14.1)
DIP_SW1: LOGIC_FPGA (U5.61), DIGITAL_IO (R12.1)
DIP_SW2: LOGIC_FPGA (U5.62), DIGITAL_IO (R10.1)
DIP_SW3: LOGIC_FPGA (U5.66), DIGITAL_IO (R8.1)
FPGA_MODE1: FPGA_POWER_AND_CONFIGURATION (J16.1 R32.2 U5.60), LOGIC_MCU (U9.12)
FPGA_RX: LOGIC_FPGA (U5.35), DIGITAL_IO (U1.17)
FPGA_SUSPEND: FPGA_POWER_AND_CONFIGURATION (R38.2 U5.73), LOGIC_MCU (U9.48)
FPGA_TX: LOGIC_FPGA (U5.34), DIGITAL_IO (U1.1)
FTDI_RST: DIGITAL_IO (R5.2 U1.11), LOGIC_MCU (U9.13)
GPMC_AD0: LOGIC_FPGA (U5.119), PERIPHERAL_PORT_IO (P29.25)
GPMC_AD1: LOGIC_FPGA (U5.118), PERIPHERAL_PORT_IO (P29.24)
GPMC_AD2: LOGIC_FPGA (U5.117), PERIPHERAL_PORT_IO (P29.5)
GPMC_AD3_PMOD1_8: LOGIC_FPGA (U5.112), PMOD_IO (J12.8), PERIPHERAL_PORT_IO (P29.6)
GPMC_AD4: LOGIC_FPGA (U5.115), PERIPHERAL_PORT_IO (P29.23)
GPMC_AD5: LOGIC_FPGA (U5.114), PERIPHERAL_PORT_IO (P1.C3 P29.22)
GPMC_AD6: LOGIC_FPGA (U5.94), PERIPHERAL_PORT_IO (P29.3)
GPMC_AD7_PMOD1_7: LOGIC_FPGA (U5.116), PMOD_IO (J12.7), PERIPHERAL_PORT_IO (P29.4)
GPMC_AD8: LOGIC_FPGA (U5.105), PERIPHERAL_PORT_IO (P1.C5 P6.18 P29.19)
GPMC_AD9: LOGIC_FPGA (U5.104), PERIPHERAL_PORT_IO (P1.C4 P29.13)
GPMC_AD10: LOGIC_FPGA (U5.102), PERIPHERAL_PORT_IO (P1.C8 P29.14)
GPMC_AD11: LOGIC_FPGA (U5.101), PERIPHERAL_PORT_IO (P1.C7 P6.16 P29.17)
GPMC_AD12: LOGIC_FPGA (U5.100), PERIPHERAL_PORT_IO (P29.12)
GPMC_AD13: LOGIC_FPGA (U5.99), PERIPHERAL_PORT_IO (P29.11)
GPMC_AD14: LOGIC_FPGA (U5.98), PERIPHERAL_PORT_IO (P1.D1 P29.16)
GPMC_AD15: LOGIC_FPGA (U5.97), PERIPHERAL_PORT_IO (P1.D2 P29.15)
GPMC_ADVN: LOGIC_FPGA (U5.95), PERIPHERAL_PORT_IO (P6.11 P29.7)
GPMC_BE0N: LOGIC_FPGA (U5.93), PERIPHERAL_PORT_IO (P6.7 P29.9)
GPMC_BE1N_PMOD1_4: LOGIC_FPGA (U5.137), PMOD_IO (J12.4), PERIPHERAL_PORT_IO (P28.12)
GPMC_CLK: LOGIC_FPGA (U5.123), PERIPHERAL_PORT_IO (P29.18)
GPMC_CSN0: LOGIC_FPGA (U5.92), PERIPHERAL_PORT_IO (P6.26 P29.26)
GPMC_CSN1: LOGIC_FPGA (U5.88), PERIPHERAL_PORT_IO (P6.22 P29.21)
GPMC_CSN2: LOGIC_FPGA (U5.87), PERIPHERAL_PORT_IO (P1.C6 P6.15 P29.20)
GPMC_OEN_PMOD1_9: LOGIC_FPGA (U5.111), PMOD_IO (J12.9), PERIPHERAL_PORT_IO (P6.12 P29.8)
GPMC_WE1N_PMOD1_10: LOGIC_FPGA (U5.134), PMOD_IO (J12.10), PERIPHERAL_PORT_IO (P6.13 P29.10)
HDMI_D1_N: LOGIC_FPGA (U5.78), PMOD_IO (J9.5)
HDMI_D1_P: LOGIC_FPGA (U5.79), PMOD_IO (J9.6)
HDMI_D2_N: LOGIC_FPGA (U5.80), PMOD_IO (J9.3)
HDMI_D2_P: LOGIC_FPGA (U5.81), PMOD_IO (J9.2)
HDMI_D3_N: LOGIC_FPGA (U5.82), PMOD_IO (J8.5)
HDMI_D3_P: LOGIC_FPGA (U5.83), PMOD_IO (J8.6)
HDMI_D4_N: LOGIC_FPGA (U5.84), PMOD_IO (J8.3)
HDMI_D4_P: LOGIC_FPGA (U5.85), PMOD_IO (J8.2)
LED0: LOGIC_FPGA (U5.41), DIGITAL_IO (R22.2)
LED1: LOGIC_FPGA (U5.43), DIGITAL_IO (R21.2)
LED2: LOGIC_FPGA (U5.44), DIGITAL_IO (R19.2)
LED3: LOGIC_FPGA (U5.45), DIGITAL_IO (R16.2)
LED4: LOGIC_FPGA (U5.46), DIGITAL_IO (R20.2)
LED5: LOGIC_FPGA (U5.47), DIGITAL_IO (R18.2)
LED6: LOGIC_FPGA (U5.48), DIGITAL_IO (R23.2)
LED7: LOGIC_FPGA (U5.50), DIGITAL_IO (R17.2)
LPC_CS_FPGA: LOGIC_FPGA (U5.141), LOGIC_MCU (U9.32)
LPC_FPGA_SLAVE_CFG_CCLK: FPGA_POWER_AND_CONFIGURATION (U8.1), LOGIC_MCU (U9.37)
LPC_FPGA_SLAVE_CFG_DIN: FPGA_POWER_AND_CONFIGURATION (U7.1), LOGIC_MCU (U9.43)
MASTER_SENSE: LOGIC_MCU (R29.2), PERIPHERAL_PORT_IO (P6.1 P28.3)
MISO: LOGIC_FPGA (U5.143), LOGIC_MCU (U6.2 U9.27), PMOD_IO (J2.3)
MOSI_SWO: LOGIC_FPGA (U5.144), LOGIC_MCU (J6.6 U6.5 U9.28), PMOD_IO (J2.2)
NetR35_1: FPGA_POWER_AND_CONFIGURATION (R35.1 U10.7), LOGIC_MCU (U9.34)
NetR49_2: FPGA_POWER_AND_CONFIGURATION (R49.2 U7.4 U8.4), LOGIC_MCU (U9.26)
PB0: LOGIC_FPGA (U5.58), DIGITAL_IO (C5.1 FPB1.B R4.2)
PB1: LOGIC_FPGA (U5.57), DIGITAL_IO (C4.1 FPB2.B R3.2)
PB2: LOGIC_FPGA (U5.56), DIGITAL_IO (C3.1 FPB3.B R2.2)
PB3: LOGIC_FPGA (U5.51), DIGITAL_IO (C2.1 FPB4.B R1.2)
PMOD1_1: LOGIC_FPGA (U5.140), PMOD_IO (J12.1)
PMOD1_2: LOGIC_FPGA (U5.139), PMOD_IO (J12.2)
PMOD1_3: LOGIC_FPGA (U5.138), PMOD_IO (J12.3)
PMOD2_1: LOGIC_FPGA (U5.10), PMOD_IO (J13.1)
PMOD2_2: LOGIC_FPGA (U5.9), PMOD_IO (J13.2)
PMOD2_3: LOGIC_FPGA (U5.8), PMOD_IO (J13.3)
PMOD2_4: LOGIC_FPGA (U5.7), PMOD_IO (J13.4)
PMOD2_7: LOGIC_FPGA (U5.6), PMOD_IO (J13.7)
PMOD2_8: LOGIC_FPGA (U5.5), PMOD_IO (J13.8)
PMOD2_9: LOGIC_FPGA (U5.2), PMOD_IO (J13.9)
PMOD2_10: LOGIC_FPGA (U5.1), PMOD_IO (J13.10)
PMOD3_1: LOGIC_FPGA (U5.22), PMOD_IO (J14.1)
PMOD3_2: LOGIC_FPGA (U5.21), PMOD_IO (J14.2)
PMOD3_3: LOGIC_FPGA (U5.17), PMOD_IO (J14.3)
PMOD3_4: LOGIC_FPGA (U5.16), PMOD_IO (J14.4)
PMOD3_7: LOGIC_FPGA (U5.15), PMOD_IO (J14.7)
PMOD3_8: LOGIC_FPGA (U5.14), PMOD_IO (J14.8)
PMOD3_9: LOGIC_FPGA (U5.12), PMOD_IO (J14.9)
PMOD3_10: LOGIC_FPGA (U5.11), PMOD_IO (J14.10)
PMOD4_1: LOGIC_FPGA (U5.133), PMOD_IO (J15.1)
PMOD4_2: LOGIC_FPGA (U5.132), PMOD_IO (J15.2)
PMOD4_3: LOGIC_FPGA (U5.131), PMOD_IO (J15.3)
PMOD4_4: LOGIC_FPGA (U5.127), PMOD_IO (J15.4)
PMOD4_7: LOGIC_FPGA (U5.126), PMOD_IO (J15.7)
PMOD4_8: LOGIC_FPGA (U5.124), PMOD_IO (J15.8)
PMOD4_9: LOGIC_FPGA (U5.121), PMOD_IO (J15.9)
PMOD4_10: LOGIC_FPGA (U5.120), PMOD_IO (J15.10)
PMOD6_1: LOGIC_MCU (U9.2), PMOD_IO (J2.1)
PMOD6_7: LOGIC_MCU (U9.18), PMOD_IO (J2.7)
PMOD6_8: LOGIC_MCU (U9.21), PMOD_IO (J2.8)
PMOD6_9: LOGIC_MCU (U9.1), PMOD_IO (J2.9)
PMOD6_10: LOGIC_MCU (U9.11), PMOD_IO (J2.10)
SCK: LOGIC_FPGA (U5.142), LOGIC_MCU (U6.6 U9.31), PMOD_IO (J2.4)
SHIELD_RST: POWER_SUPPLY (P1.A1), LOGIC_FPGA (U5.40)
SLAVE_CFG_DONE: FPGA_POWER_AND_CONFIGURATION (D5.A P9.3 U5.71), LOGIC_MCU (U9.9)
SLAVE_CFG_INIT_B: FPGA_POWER_AND_CONFIGURATION (P9.2 R27.1 U5.39), LOGIC_MCU (U9.23)
SLAVE_CFG_PROG_B: FPGA_POWER_AND_CONFIGURATION (P9.1 R24.1 U5.37), LOGIC_MCU (U9.17)
SYS_I2C_SCL: LOGIC_FPGA (U5.23), LOGIC_MCU (R25.1 U9.15), PERIPHERAL_PORT_IO (P1.D10 P6.5 P28.19)
SYS_I2C_SDA: LOGIC_FPGA (U5.24), LOGIC_MCU (R26.1 U9.16), PERIPHERAL_PORT_IO (P1.D9 P6.3 P28.20)
SYS_RX: LOGIC_FPGA (U5.33), PERIPHERAL_PORT_IO (P1.C1 P6.10 P28.26)
SYS_SPI_MISO: LOGIC_FPGA (U5.27), PERIPHERAL_PORT_IO (P1.D5 P6.21 P28.21)
SYS_SPI_MOSI: LOGIC_FPGA (U5.29), FPGA_POWER_AND_CONFIGURATION (U7.3), PERIPHERAL_PORT_IO (P1.D4 P6.19 P28.18)
SYS_SPI_SCK: LOGIC_FPGA (U5.26), FPGA_POWER_AND_CONFIGURATION (U8.3), PERIPHERAL_PORT_IO (P1.D6 P6.23 P28.22)
SYS_SPI_SS: LOGIC_FPGA (U5.30), PERIPHERAL_PORT_IO (P6.24 P28.17)
SYS_TX: LOGIC_FPGA (U5.32), PERIPHERAL_PORT_IO (P1.C2 P6.8 P28.24)

## Assembly variants
NO_THRU-HOLE: not fitted C28 D6 DC9 DC10 DC11 DC12 DC13 DC14 DC15 DC16 J2 J5 J6 J12 J13 J14 J15 P1
PMODS: not fitted D6 J5 J6 P1; alternate parts J2 -> =Value, J13 -> =Value, J14 -> =Value, J15 -> =Value